# EAGLE design PPMCapture (EAGLE 9.6.2)
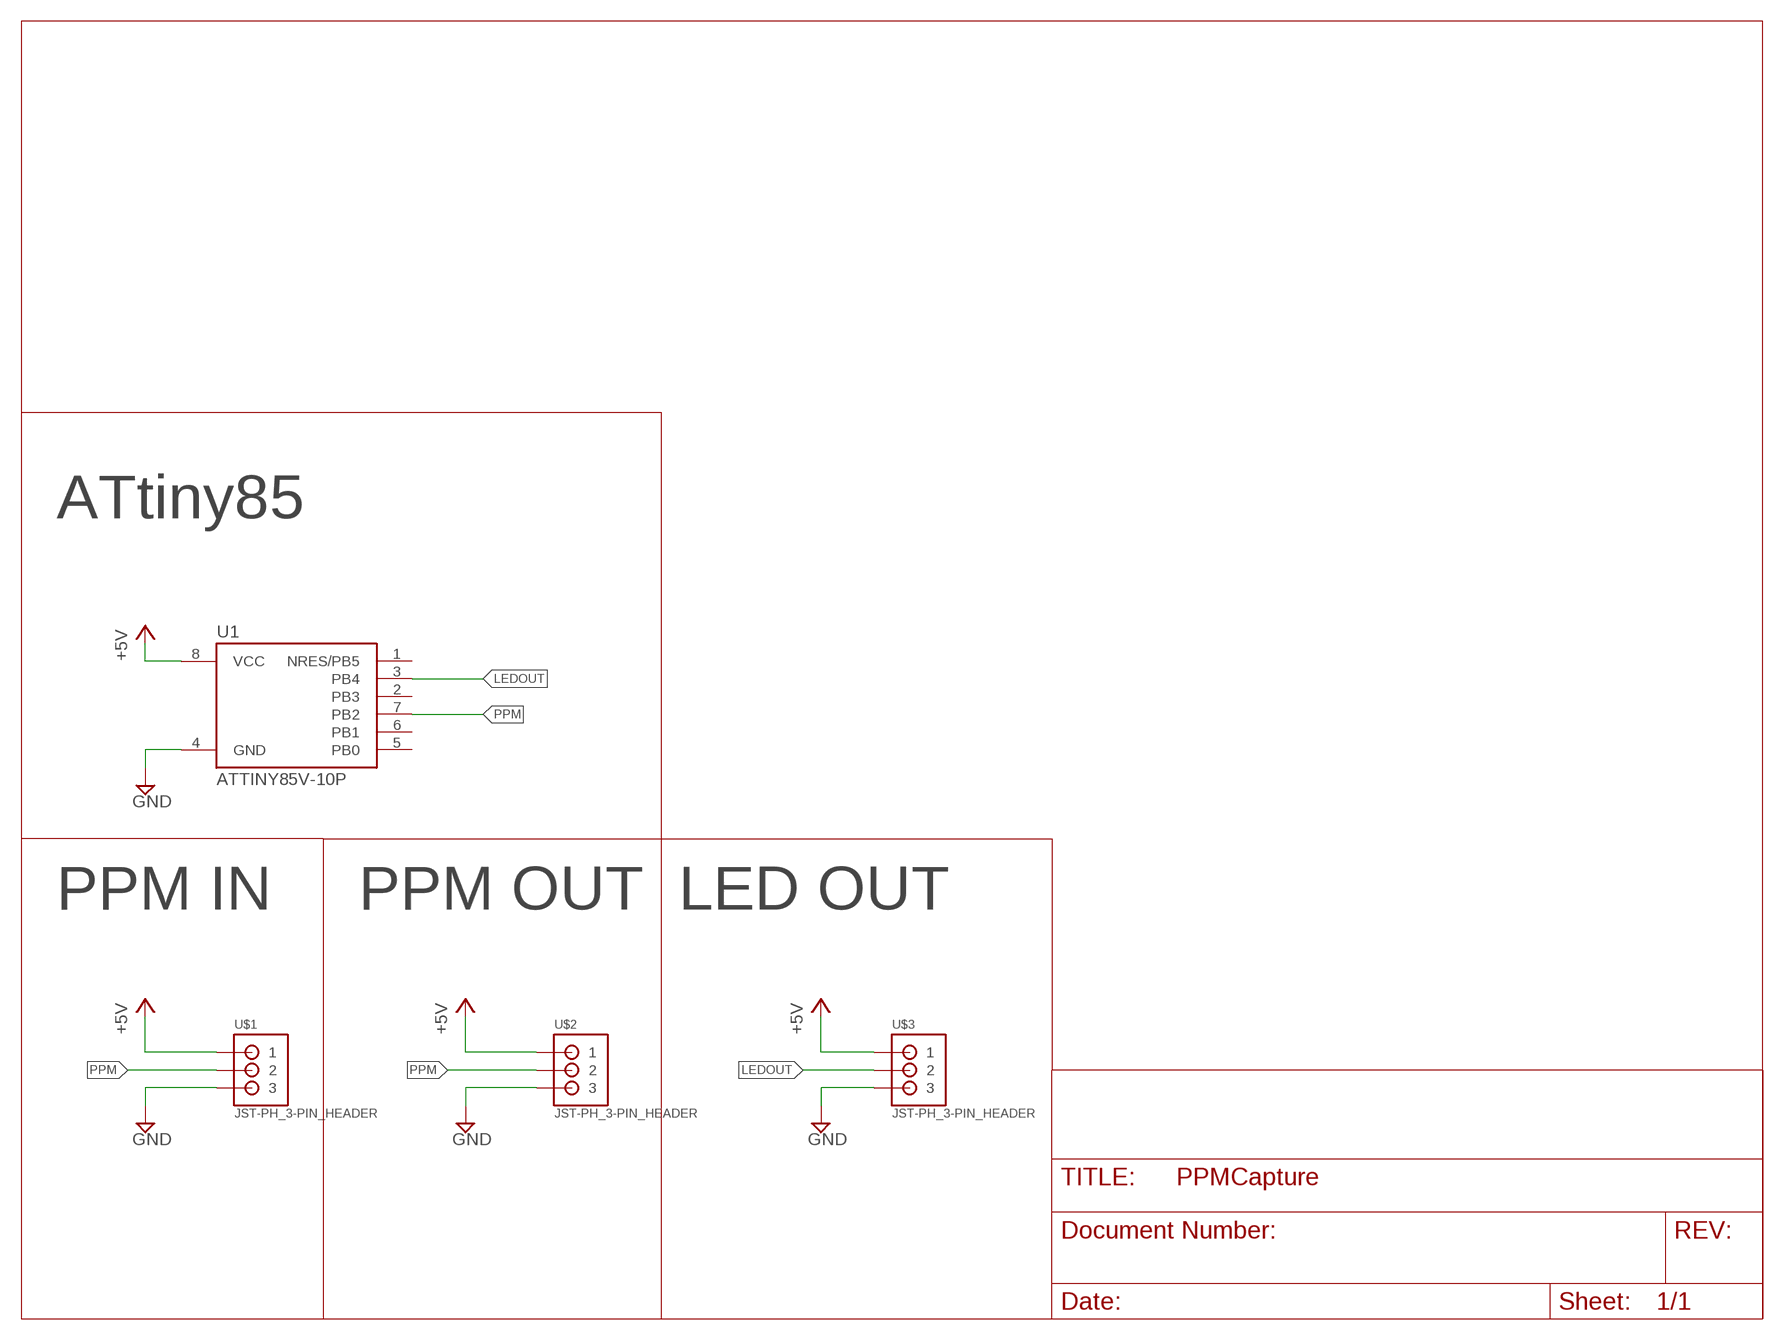
[diagram p0: schematic, sheet 1]

## Parts
U1  ATTINY85V-10P  [PDIP08_300MIL]
U$1  JST-PH_3-PIN_HEADER  [JST_B3B-PH_HEADER]
U$2  JST-PH_3-PIN_HEADER  [JST_B3B-PH_HEADER]
U$3  JST-PH_3-PIN_HEADER  [JST_B3B-PH_HEADER]

## Nets
+5V: U1.8(VCC) U$1.P1 U$2.P1 U$3.P1
GND: U1.4(GND) U$1.P3 U$2.P3 U$3.P3
LEDOUT: U1.3(PB4) U$3.P2
PPM: U1.7(PB2) U$1.P2 U$2.P2
Unconnected: U1.1(NRES/PB5) U1.2(PB3) U1.5(PB0) U1.6(PB1)

## Notes on the sheet
- ATtiny85
- PPM IN | PPM OUT | LED OUT

## Library data of the parts
U1 = _hhn_attiny25_45_85:ATTINY85*: ATMEL ATtiny 85 Packages: P = PDIP 08 30mil S = SOIC 08 EIAJ 208mil Technologies Note: for complete ordering code (temp. range, finish, tape&reel etc.) see www.atmel.com • Supply Voltage: V = (1.8…5.5)V | [blank] = (2.7…5.5)V • Speed: 10 = 10 MHz | 20 = 20 MHz Author: Dipl.-Ing. FH Rainer Bayer HHN Hochschule Heilbronn (Heilbronn University), rainer.bayer@hs-heilbronn.de Ingenieurbüro ing-rb, mail@ing-rb.de
U$1-U$3 = SRG:JST-PH_3-PIN_HEADER: 3-pin JST PH Shrouded Header, top entry P/N B3B-PH-K-S Mating connector PHR-3

## Board
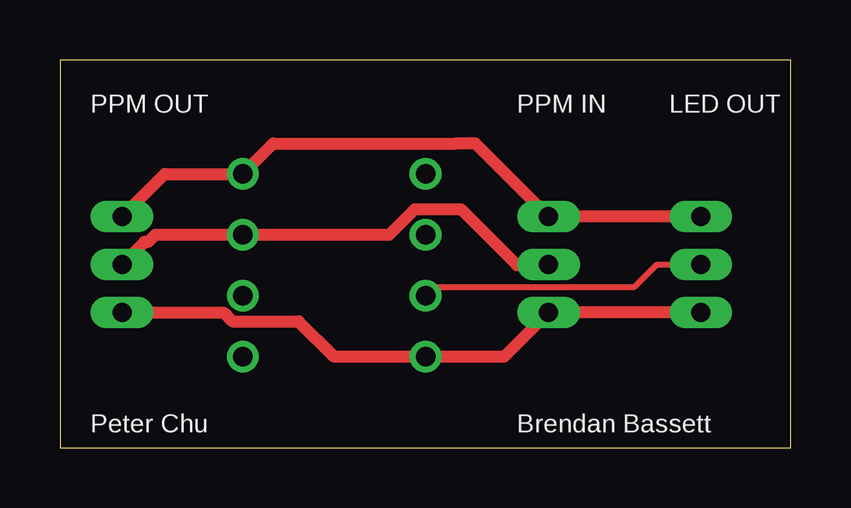
[diagram p1: board, top side]
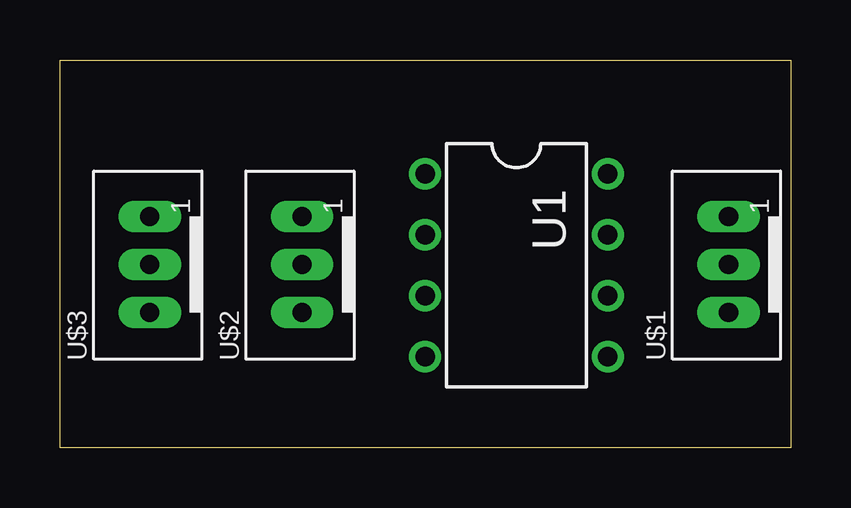
[diagram p2: board, bottom side, seen from below]

Size 30.46 x 16.18 mm. Coordinates in mm from the lower left corner, seen from the top.
Outline: 0,0 30.46,0 30.46,16.18 0,16.18 0,0
Copper layers (1*16): Top 0.035mm / dielectric 1.5mm / Bottom 0.035mm
Design rules "default": minimum track width 6mil, minimum drill 0.35mm, track to track 6mil, track to pad 6mil, pad to pad 6mil, via to via 6mil, smd to smd 6mil, copper to edge 40mil, drill to drill 6mil, minimum pad ring 10mil, minimum via ring 8mil, stop-mask expansion 4mil, vias tented up to drill 0mil, thermal gap 10mil

### Footprints (pad centres in the part's own frame; a part is rotated, then mirrored left to right if it is on the bottom)
PDIP08_300MIL = drill 0.813: 1 -3.81,-3.81; 2 -1.27,-3.81; 3 1.27,-3.81; 4 3.81,-3.81; 5 3.81,3.81; 6 1.27,3.81; 7 -1.27,3.81; 8 -3.81,3.81
JST_B3B-PH_HEADER = drill 0.8 long: P1 2.027,0.048; P2 0.028,0.048; P3 -1.972,0.048

### Placement (x,y rotation side)
U1  11.43,7.62 270 bottom
U$1  2.54,7.62 90 bottom
U$2  20.32,7.62 90 bottom
U$3  26.67,7.62 90 bottom

### Tracks (layer width: path | path; a pad name or v marks a point on that pad's centre or on a via)
+5V
  Top 0.508: U$1.P1 4.37,11.43 U1.8 8.89,12.7 16.51,12.7 17.32,12.7 U$2.P1 U$3.P1
GND
  Top 0.508: U$1.P3 6.81,5.65 7.18,5.28 9.96,5.28 11.43,3.81 U1.4 18.53,3.81 U$2.P3 U$3.P3
LEDOUT
  Top 0.254: U$3.P2 24.88,7.65 23.95,6.71 15.6,6.71 U1.3
PPM
  Top 0.508: U$1.P2 3.53,8.59 3.68,8.59 3.98,8.89 U1.7 13.73,8.89 14.8,9.96 16.71,9.96 19.05,7.62 20.34,7.62 U$2.P2

### Text on the board
tNames: PPM OUT | PPM IN | LED OUT | Peter Chu | Brendan Bassett